# Altium schematic sheet Copy of Sheet1.SchDoc
size A4; SheetNumber: 1; SheetTotal: 1; SPICEModelCacheHSNNAYIC: <root> / <DocumentId>HSNNAYIC</DocumentId> / <CacheFrame Number="0"> / <Model Name="nmos" Kind="MDL"> / <Text>*Default N-Channel MOSFET / *Pinout: D,G,S / .MODEL NMOS NMOS()</Text> / </Model> / <Model Name="pmos" Kind="MDL"> / <Text>*Default P-Channel MOSFET / *Pinout: D,G,S / .MODEL PMOS PMOS()</Text> / </Model> / <Model Name="diode" Kind="MDL"> / <Text>*Default Diode / *Diode Pinout: A,K / .MODEL DIODE D()</Text> / </Model> / </CacheFrame> / </root>
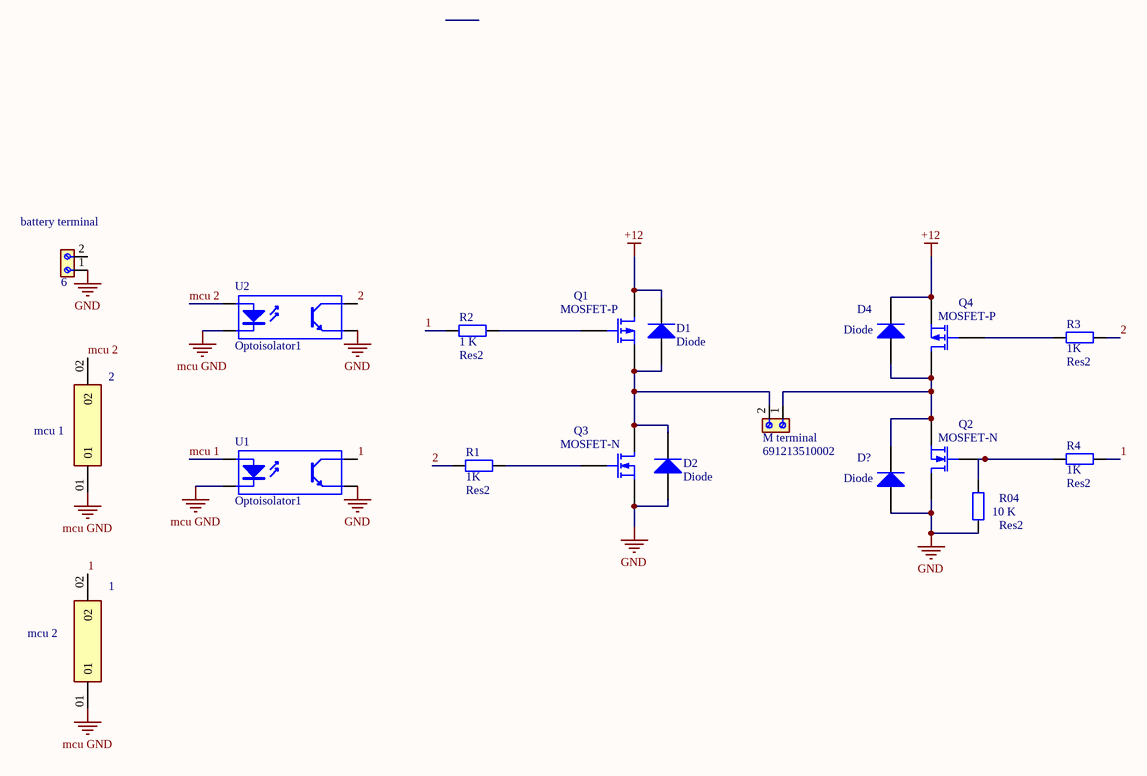
[diagram p0: Copy of Sheet1.SchDoc]

## Parts
1  mcu 2  [SAMTEC_MTMM-101-15-G-D-105]
2  mcu 1  [SAMTEC_MTMM-101-15-G-D-105]
battery_terminal  6  [691213510002]
D1  Diode  [SMC]
D2  Diode  [SMC]
D4  Diode  [SMC]
D?  Diode  [SMC]
M_terminal  691213510002  [691213510002]
Q1  MOSFET-P  [E3]
Q2  MOSFET-N  [E3]
Q3  MOSFET-N  [E3]
Q4  MOSFET-P  [E3]
R1  Res2  value 1K  [AXIAL-0.4]
R2  Res2  value 1 K  [AXIAL-0.4]
R3  Res2  value 1K  [AXIAL-0.4]
R4  Res2  value 1K  [AXIAL-0.4]
R04  Res2  value 10 K  [AXIAL-0.4]
U1  Optoisolator1  [DIP-4]
U2  Optoisolator1  [DIP-4]

## Nets
+12: D1.2(K) D4.2(K) Q1.1(D) Q4.3(S)
GND: battery_terminal.1 D2.1(A) D?.1(A) Q2.1(D) Q3.3(S) R04.1 U1.3(E) U2.3(E)
mcu GND: 1.01 2.01 U1.2(K) U2.2(K)
1: 1.02 R2.2 R4.2 U1.4(C)
2: R1.1 R3.2 U2.4(C)
mcu 1: U1.1(A)
mcu 2: 2.02 U2.1(A)
NetD1_1: D1.1(A) D2.2(K) M_terminal.2 Q1.3(S) Q3.1(D)
NetD4_1: D4.1(A) D?.2(K) M_terminal.1 Q2.3(S) Q4.1(D)
NetQ1_2: Q1.2(G) R2.1
NetQ2_2: Q2.2(G) R4.1 R04.2
NetQ3_2: Q3.2(G) R1.2
NetQ4_2: Q4.2(G) R3.1

Not connected (* = marked no-connect by the designer): battery_terminal 2

## Library data of the parts
1 2 = MTMM-101-15-G-D-105: Connector Header Through Hole 2 position; MF: Samtec; Check_prices: https://www.snapeda.com/parts/MTMM-101-15-G-D-105/Samtec/view-part/?ref=eda; Value: *; Availability: In Stock; MP: MTMM-101-15-G-D-105; Price: None; Package: None; SnapEDA_Link: https://www.snapeda.com/parts/MTMM-101-15-G-D-105/Samtec/view-part/?ref=snap; Purchase-URL: https://pricing.snapeda.com/search/part/MTMM-101-15-G-D-105/?ref=eda
battery_terminal M_terminal = 691213510002: 2 Position Wire to Board Terminal Block Horizontal with Board 0.200 (5.08mm) Through Hole; MF: Wurth Electronics; SnapEDA_Link: https://www.snapeda.com/parts/691213510002/Wurth+Electronics/view-part/?ref=snap; Package: None; Value: *; MP: 691213510002; Check_prices: https://www.snapeda.com/parts/691213510002/Wurth+Electronics/view-part/?ref=eda
D1 D2 D4 D? = Diode: Default Diode; Published: 8-Jun-2000; LatestRevisionDate: 17-Jul-2002; LatestRevisionNote: Re-released for DXP Platform.; PackageVersion: Sep-1996; PackageReference: SMC; Publisher: Altium Limited; PackageDescription: DO-214-AB/SMC; 2 C-Bend Leads; Body 7.9 x 5.9 mm, inc. leads (LxW); Code_JEDEC: DO-214-AB
Q1 Q4 = MOSFET-P: P-Channel MOSFET; Published: 8-Jun-2000; LatestRevisionDate: 17-Jul-2002; LatestRevisionNote: Re-released for DXP Platform.; PackageVersion: 1995/1996; PackageReference: E3; Publisher: Altium Limited; PackageDescription: TO, Flat Index; 3 In-Line, Axial Leads; Body Dia. 4.6mm; Lead Dia. 0.5 mm (max)
Q2 Q3 = MOSFET-N: N-Channel MOSFET; Published: 8-Jun-2000; LatestRevisionDate: 17-Jul-2002; LatestRevisionNote: Re-released for DXP Platform.; PackageVersion: 1995/1996; PackageReference: E3; Publisher: Altium Limited; PackageDescription: TO, Flat Index; 3 In-Line, Axial Leads; Body Dia. 4.6mm; Lead Dia. 0.5 mm (max)
R1-R4 R04 = Res2: Resistor; Published: 8-Jun-2000; LatestRevisionDate: 17-Jul-2002; LatestRevisionNote: Re-released for DXP Platform.; PackageReference: AXIAL-0.4; Publisher: Altium Limited; PackageDescription: Axial Device, Thru-Hole; 2 Leads; 0.4 in Pin Spacing
U1 U2 = Optoisolator1: 4-Pin Phototransistor Optocoupler; Published: 24-Mar-1999; LatestRevisionDate: 04-Mar-2005; LatestRevisionNote: Sch pins 3 & 4 Swapped.; DatasheetVersion: Nov-2003; PackageReference: DIP-4; Publisher: Altium Limited